# Altium project sigmaDeltaAltium.PrjPcb
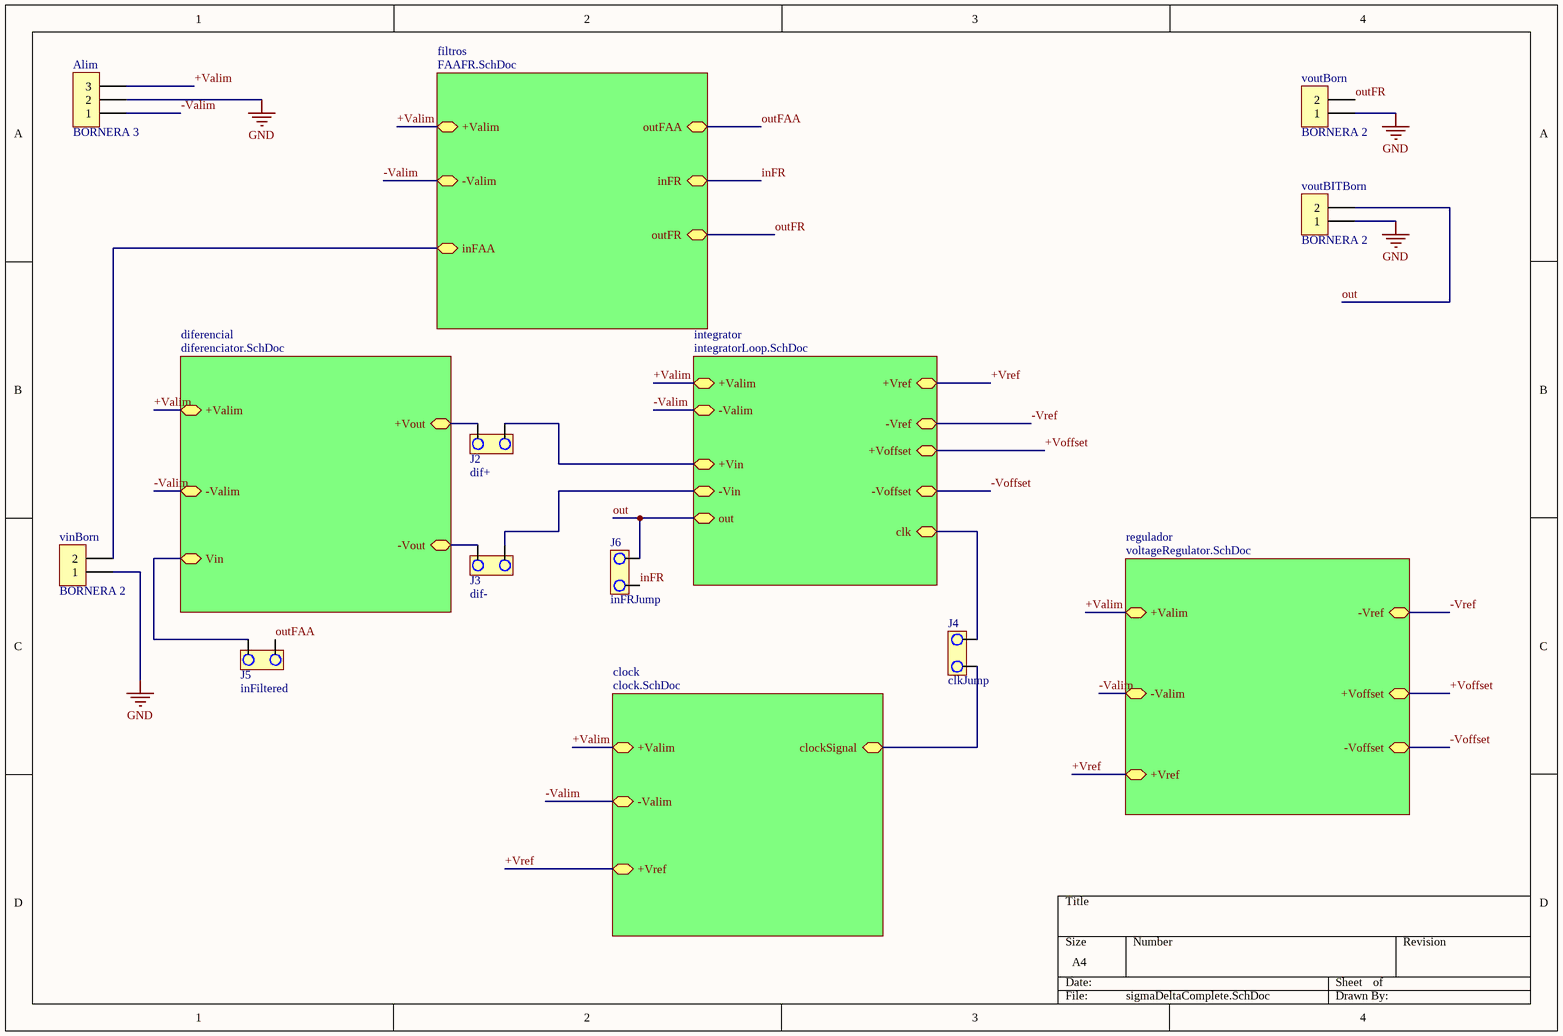
[diagram p0: sigmaDeltaComplete.SchDoc]
6 sheets, 68 parts. Net scope: hierarchical (ports join the sheet entries above them; power ports are global).
Board file: sigmaDeltaAUX.PcbDoc
Sheets:
  sigmaDeltaComplete.SchDoc
    integrator = integratorLoop.SchDoc
    clock = clock.SchDoc
    diferencial = diferenciator.SchDoc
    regulador = voltageRegulator.SchDoc
    filtros = FAAFR.SchDoc

## Sheet sigmaDeltaComplete.SchDoc
size A4

### Parts
Alim  BORNERA 3  [BORNERA3]
J2  dif+  [JUMPER2]
J3  dif-  [JUMPER2]
J4  clkJump  [JUMPER2]
J5  inFiltered  [JUMPER2]
J6  inFRJump  [JUMPER2]
vinBorn  BORNERA 2  [BORNERA2]
voutBITBorn  BORNERA 2  [BORNERA2]
voutBorn  BORNERA 2  [BORNERA2]

### Sub-sheets
clock = clock.SchDoc: +Valim, -Valim, +Vref, clockSignal
diferencial = diferenciator.SchDoc: +Valim, -Valim, Vin, +Vout, -Vout
filtros = FAAFR.SchDoc: +Valim, -Valim, inFAA, outFAA, inFR, outFR
integrator = integratorLoop.SchDoc: +Valim, -Valim, +Vin, -Vin, out, +Vref, -Vref, +Voffset, -Voffset, clk
regulador = voltageRegulator.SchDoc: +Valim, -Valim, +Vref, -Vref, +Voffset, -Voffset

### Nets
GND: Alim.2 vinBorn.1 voutBITBorn.1 voutBorn.1
+Valim: Alim.3 ; sheet integrator/+Valim, sheet clock/+Valim, sheet diferencial/+Valim, sheet regulador/+Valim, sheet filtros/+Valim
+Vin: J2.2 ; sheet integrator/+Vin
+Voffset: sheet integrator/+Voffset, sheet regulador/+Voffset
+Vout: J2.1 ; sheet diferencial/+Vout
+Vref: sheet integrator/+Vref, sheet clock/+Vref, sheet regulador/+Vref
-Valim: Alim.1 ; sheet integrator/-Valim, sheet clock/-Valim, sheet diferencial/-Valim, sheet regulador/-Valim, sheet filtros/-Valim
-Vin: J3.2 ; sheet integrator/-Vin
-Voffset: sheet integrator/-Voffset, sheet regulador/-Voffset
-Vout: J3.1 ; sheet diferencial/-Vout
-Vref: sheet integrator/-Vref, sheet regulador/-Vref
clk: J4.1 ; sheet integrator/clk
clockSignal: J4.2 ; sheet clock/clockSignal
inFR: J6.2 ; sheet filtros/inFR
out: J6.1 voutBITBorn.2 ; sheet integrator/out  [project net analogResult2]
outFAA: J5.2 ; sheet filtros/outFAA
outFR: voutBorn.2 ; sheet filtros/outFR
NetJ5_1: J5.1 ; sheet diferencial/Vin
NetR1_filtros_2: vinBorn.2 ; sheet filtros/inFAA

### Library data of the parts
J2-J6 = JUMPER

## Sheet integratorLoop.SchDoc
size A4
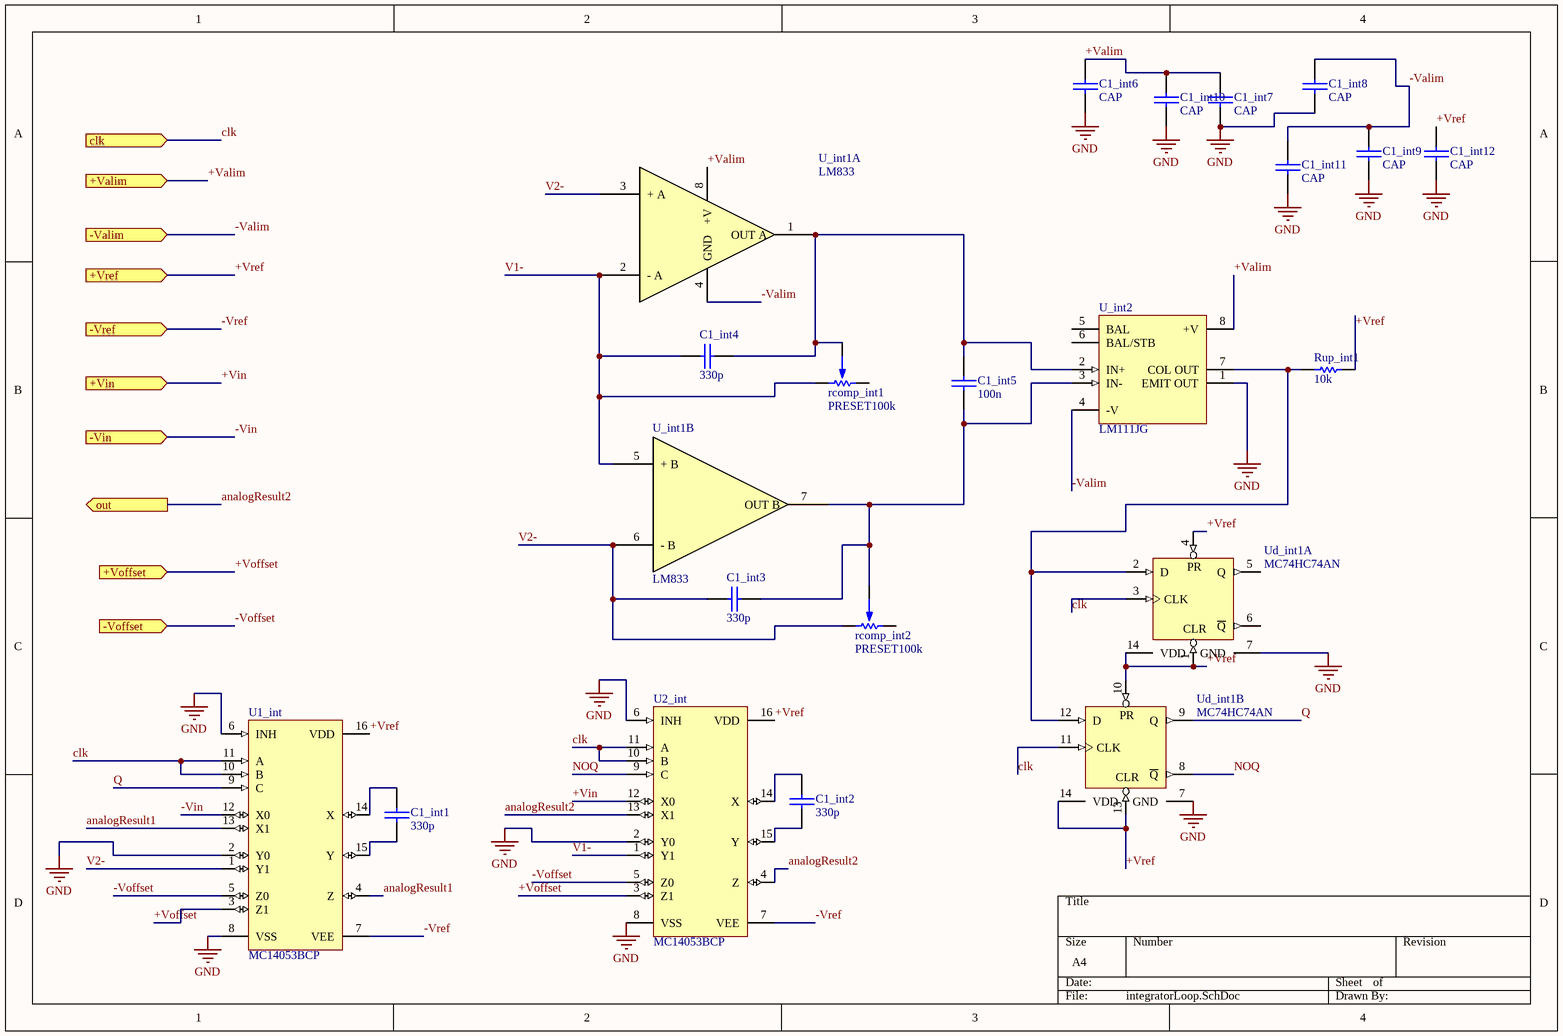
[diagram p1: integratorLoop.SchDoc]

### Parts
C1_int1  330p  [CAP200]
C1_int2  330p  [CAP200]
C1_int3  330p  [CAP200]
C1_int4  330p  [CAP200]
C1_int5  100n  [CAP200]
C1_int6  CAP  [CAP200]
C1_int7  CAP  [CAP200]
C1_int8  CAP  [CAP200]
C1_int9  CAP  [CAP200]
C1_int10  CAP  [CAP200]
C1_int11  CAP  [CAP200]
C1_int12  CAP  [CAP200]
rcomp_int1  PRESET100k  [PRESET V]
rcomp_int2  PRESET100k  [PRESET V]
Rup_int1  10k  [RES300]
U1_int  MC14053BCP  [648-08]
U2_int  MC14053BCP  [648-08]
U_int1  LM833  [DIP8]  (parts A,B of 2)
U_int2  LM111JG  [JG008]
Ud_int1  MC74HC74AN  [646-06]  (parts A,B of 2)

### Ports
+Valim (in), +Vin (in), +Voffset (in), +Vref (in), -Valim (in), -Vin (in), -Voffset (in), -Vref (in), clk (in), out (out)

### Nets
GND: C1_int6.2 C1_int7.2 C1_int8.2 C1_int9.2 C1_int10.2 C1_int11.2 C1_int12.2 U1_int.2(Y0) U1_int.6(INH) U1_int.8(VSS) U2_int.2(Y0) U2_int.6(INH) U2_int.8(VSS) U_int2.1(EMIT_OUT) Ud_int1.7(GND)
+Valim: C1_int6.1 C1_int7.1 C1_int10.1 U_int1.8(+V) U_int2.8(+V) ; port +Valim
+Vin: U2_int.12(X0) ; port +Vin
+Voffset: U1_int.3(Z1) U2_int.3(Z1) ; port +Voffset
+Vref: C1_int12.1 Rup_int1.2 U1_int.16(VDD) U2_int.16(VDD) Ud_int1.1(CLR) Ud_int1.4(PR) Ud_int1.10(PR) Ud_int1.13(CLR) Ud_int1.14(VDD) ; port +Vref
-Valim: C1_int8.1 C1_int9.1 C1_int11.1 U_int1.4(GND) U_int2.4(-V) ; port -Valim
-Vin: U1_int.12(X0) ; port -Vin
-Voffset: U1_int.5(Z0) U2_int.5(Z0) ; port -Voffset
-Vref: U1_int.7(VEE) U2_int.7(VEE) ; port -Vref
analogResult1: U1_int.4(Z) U1_int.13(X1)
analogResult2: U2_int.4(Z) U2_int.13(X1) ; port out
clk: U1_int.10(B) U1_int.11(A) U2_int.10(B) U2_int.11(A) Ud_int1.3(CLK) Ud_int1.11(CLK) ; port clk
NOQ: U2_int.9(C) Ud_int1.8(~{Q})
Q: U1_int.9(C) Ud_int1.9(Q)
V1-: C1_int4.1 rcomp_int1.1 U2_int.1(Y1) U_int1.2(-_A) U_int1.5(+_B)
V2-: C1_int3.1 rcomp_int2.1 U1_int.1(Y1) U_int1.3(+_A) U_int1.6(-_B)
NetC1_int1_1: C1_int1.1 U1_int.14(X)
NetC1_int1_2: C1_int1.2 U1_int.15(Y)
NetC1_int2_1: C1_int2.1 U2_int.14(X)
NetC1_int2_2: C1_int2.2 U2_int.15(Y)
NetC1_int3_2: C1_int3.2 C1_int5.2 rcomp_int2.2 U_int1.7(OUT_B) U_int2.3(IN-)
NetC1_int4_2: C1_int4.2 C1_int5.1 rcomp_int1.2 U_int1.1(OUT_A) U_int2.2(IN+)
NetRup_int1_1: Rup_int1.1 U_int2.7(COL_OUT) Ud_int1.2(D) Ud_int1.12(D)

Not connected (* = marked no-connect by the designer): rcomp_int1 3; rcomp_int2 3; U_int2 5(BAL) 6(BAL/STB); Ud_int1 5(Q) 6(~{Q})

### Library data of the parts
C1_int1-C1_int5 = CAP
rcomp_int1 rcomp_int2 = PRESET
Rup_int1 = RES
U1_int U2_int = MC14053BCP: Triple 2-Channel Analog Multiplexer/Demultiplexer; Published: 15-Apr-2002; DatasheetVersion: 1995; PackageVersion: Apr-2000; PackageReference: 648-08; Publisher: Altium Limited; PackageDescription: DIP; 16 Leads; Row Spacing 7.62 mm; Pitch 2.54 mm; Code_JEDEC: MS-001-BB; ComponentLink1Description: Manufacturer Link; ComponentLink1URL: http://www.onsemi.com/; ComponentLink2Description: Datasheet; ComponentLink2URL: http://www.onsemi.com/pub/Collateral/MC14051B-D.PDF
U_int1 = LM833: Dual Audio Operational Amplifier
U_int2 = LM111JG: Differential Comparator with Strobe; Published: 16-Jan-2001; LatestRevisionDate: 04-Mar-2005; LatestRevisionNote: Stylized 3D Model Added.; DatasheetVersion: Feb-1992; PackageVersion: Jan-1995; PackageReference: JG008; Publisher: Altium Limited; PackageDescription: DIP; 8 Leads; Row Spacing 7.62 mm; Pitch 2.54 mm; ComponentLink1Description: Manufacturer Link; ComponentLink1URL: http://www.ti.com/; ComponentLink2Description: Datasheet; ComponentLink2URL: http://www-s.ti.com/sc/ds/lm111.pdf
Ud_int1 = MC74HC74AN: Dual D-Type Flip-Flop with Set and Reset; Published: 15-Apr-2002; DatasheetVersion: Mar-2000; PackageVersion: 1995; PackageReference: 646-06; Publisher: Altium Limited; PackageDescription: DIP; 14 Leads; Row Spacing 7.62 mm; Pitch 2.54 mm; ComponentLink1Description: Manufacturer Link; ComponentLink1URL: http://www.onsemi.com/; ComponentLink2Description: Datasheet; ComponentLink2URL: http://www.onsemi.com/pub/Collateral/MC74HC74A-D.PDF

## Sheet clock.SchDoc
size A4
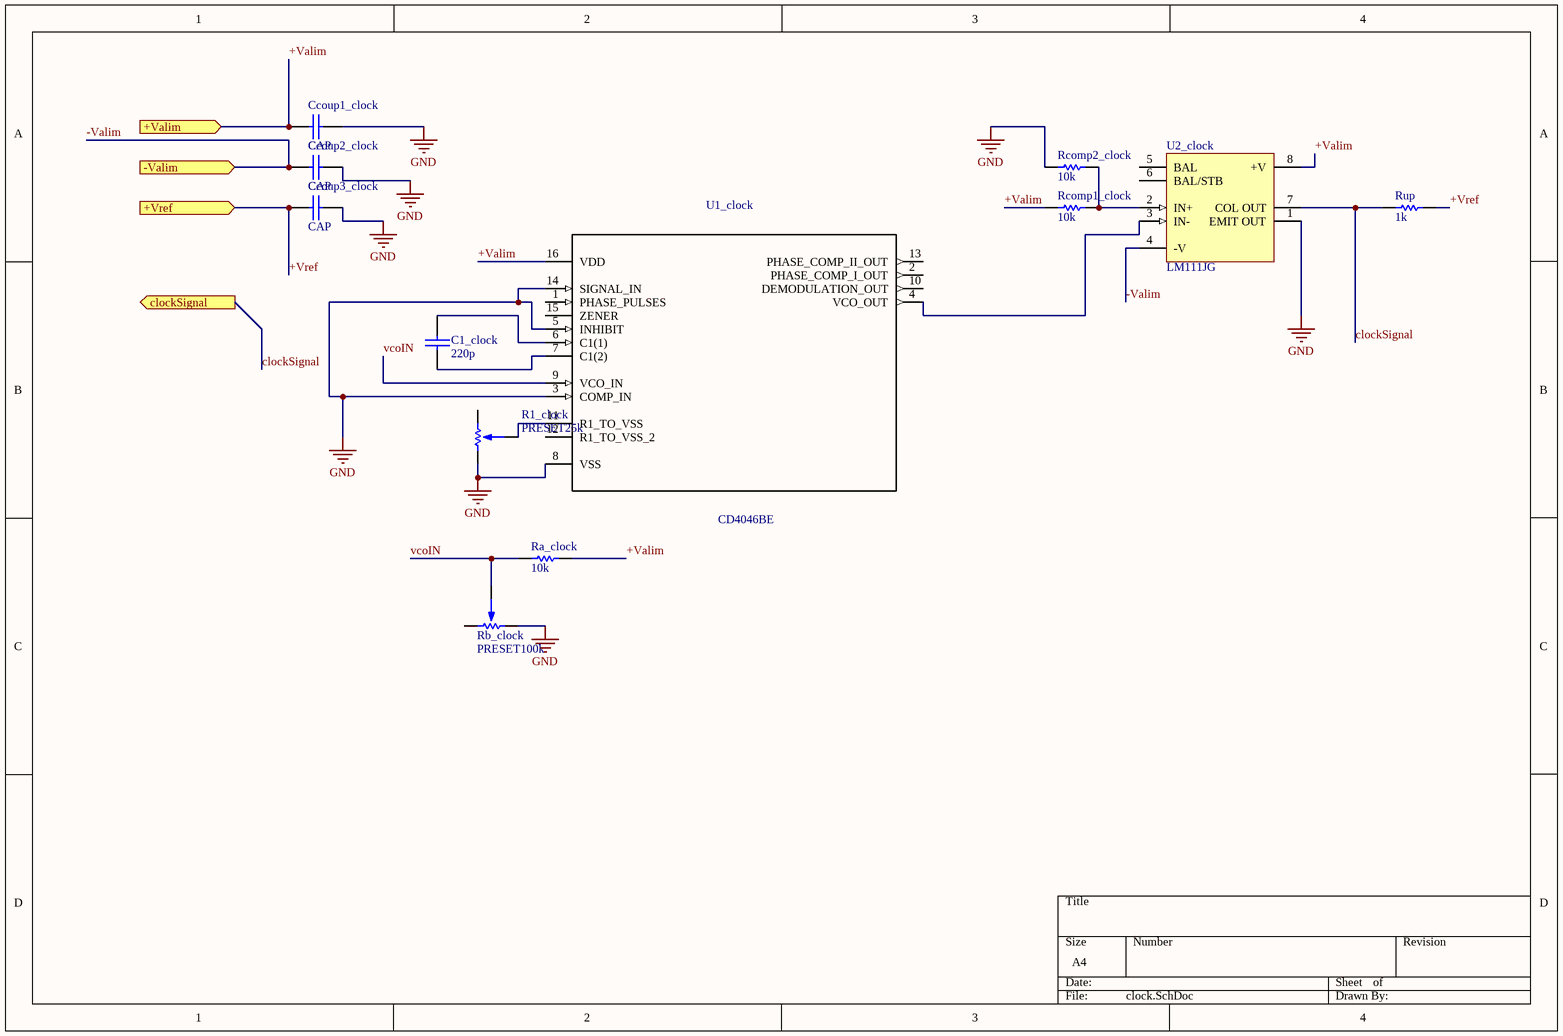
[diagram p2: clock.SchDoc]

### Parts
C1_clock  220p  [CAP200]
Ccoup1_clock  CAP  [CAP200]
Ccoup2_clock  CAP  [CAP200]
Ccoup3_clock  CAP  [CAP200]
R1_clock  PRESET25k  [PRESET V]
Ra_clock  10k  [RES300]
Rb_clock  PRESET100k  [PRESET V]
Rcomp1_clock  10k  [RES300]
Rcomp2_clock  10k  [RES300]
Rup  1k  [RES300]
U1_clock  CD4046BE  [DIP254P762X508-16]
U2_clock  LM111JG  [JG008]

### Ports
+Valim (in), +Vref (in), -Valim (in), clockSignal (out)

### Nets
GND: Ccoup1_clock.2 Ccoup2_clock.2 Ccoup3_clock.2 R1_clock.3 Rb_clock.3 Rcomp2_clock.1 U1_clock.3(COMP_IN) U1_clock.5(INHIBIT) U1_clock.8(VSS) U1_clock.14(SIGNAL_IN) U2_clock.1(EMIT_OUT)
+Valim: Ccoup1_clock.1 Ra_clock.2 Rcomp1_clock.1 U1_clock.16(VDD) U2_clock.8(+V) ; port +Valim
+Vref: Ccoup3_clock.1 Rup.2 ; port +Vref
-Valim: Ccoup2_clock.1 U2_clock.4(-V) ; port -Valim
clockSignal: Rup.1 U2_clock.7(COL_OUT) ; port clockSignal
vcoIN: Ra_clock.1 Rb_clock.2 U1_clock.9(VCO_IN)
NetC1_clock_1: C1_clock.1 U1_clock.6(C1(1))
NetC1_clock_2: C1_clock.2 U1_clock.7(C1(2))
NetR1_clock_2: R1_clock.2 U1_clock.11(R1_TO_VSS)
NetRcomp1_clock_2: Rcomp1_clock.2 Rcomp2_clock.2 U2_clock.2(IN+)
NetU1_clock_4: U1_clock.4(VCO_OUT) U2_clock.3(IN-)

Not connected (* = marked no-connect by the designer): R1_clock 1; Rb_clock 1; U1_clock 1(PHASE_PULSES) 2(PHASE_COMP_I_OUT) 10(DEMODULATION_OUT) 12(R1_TO_VSS_2) 13(PHASE_COMP_II_OUT) 15(ZENER); U2_clock 5(BAL) 6(BAL/STB)

### Library data of the parts
C1_clock = CAP
R1_clock Rb_clock = PRESET
Ra_clock Rcomp1_clock Rcomp2_clock Rup = RES
U1_clock = CD4046BE: Logic - Phase-Locked-Loops and Oscillators Micropower PLL; MF: Texas Instruments; SnapEDA_Link: https://www.snapeda.com/parts/CD4046BE/Texas%20Instruments/view-part/?ref=snap; Availability: Unavailable; Package: PDIP-16 Texas Instruments; Price: None; MP: CD4046BE; Value: *
U2_clock = LM111JG: Differential Comparator with Strobe; Published: 16-Jan-2001; LatestRevisionDate: 04-Mar-2005; LatestRevisionNote: Stylized 3D Model Added.; DatasheetVersion: Feb-1992; PackageVersion: Jan-1995; PackageReference: JG008; Publisher: Altium Limited; PackageDescription: DIP; 8 Leads; Row Spacing 7.62 mm; Pitch 2.54 mm; ComponentLink1Description: Manufacturer Link; ComponentLink1URL: http://www.ti.com/; ComponentLink2Description: Datasheet; ComponentLink2URL: http://www-s.ti.com/sc/ds/lm111.pdf

## Sheet diferenciator.SchDoc
size A4
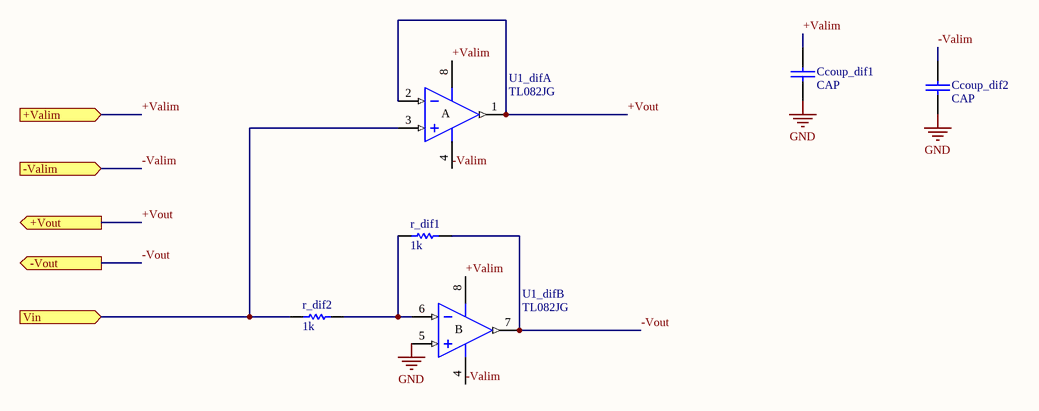
[diagram p3: diferenciator.SchDoc]

### Parts
Ccoup_dif1  CAP  [CAP200]
Ccoup_dif2  CAP  [CAP200]
r_dif1  1k  [RES300]
r_dif2  1k  [RES300]
U1_dif  TL082JG  [JG008]  (parts A,B of 2)

### Ports
+Valim (in), +Vout (out), -Valim (in), -Vout (out), Vin (in)

### Nets
GND: Ccoup_dif1.2 Ccoup_dif2.2 U1_dif.5(IN+)
+Valim: Ccoup_dif1.1 U1_dif.8(V+) ; port +Valim
+Vout: U1_dif.1(OUT) U1_dif.2(IN-) ; port +Vout
-Valim: Ccoup_dif2.1 U1_dif.4(V-) ; port -Valim
-Vout: r_dif1.2 U1_dif.7(OUT) ; port -Vout
NetJ5_1: r_dif2.1 U1_dif.3(IN+) ; port Vin
Netr_dif1_1: r_dif1.1 r_dif2.2 U1_dif.6(IN-)

### Notes on the sheet
- (in symbol TL082JG, part A) A
- (in symbol TL082JG, part B) B

### Library data of the parts
r_dif1 r_dif2 = RES
U1_dif = TL082JG: JFET-Input Operational Amplifier; Published: 16-Jan-2001; LatestRevisionDate: 04-Mar-2005; LatestRevisionNote: Stylized 3D Model Added.; DatasheetVersion: Feb-1999; PackageVersion: Jan-1995; PackageReference: JG008; Publisher: Altium Limited; PackageDescription: DIP; 8 Leads; Row Spacing 7.62 mm; Pitch 2.54 mm; ComponentLink1Description: Manufacturer Link; ComponentLink1URL: http://www.ti.com/; ComponentLink2Description: Datasheet; ComponentLink2URL: http://www-s.ti.com/sc/ds/tl082.pdf

## Sheet voltageRegulator.SchDoc
size A4
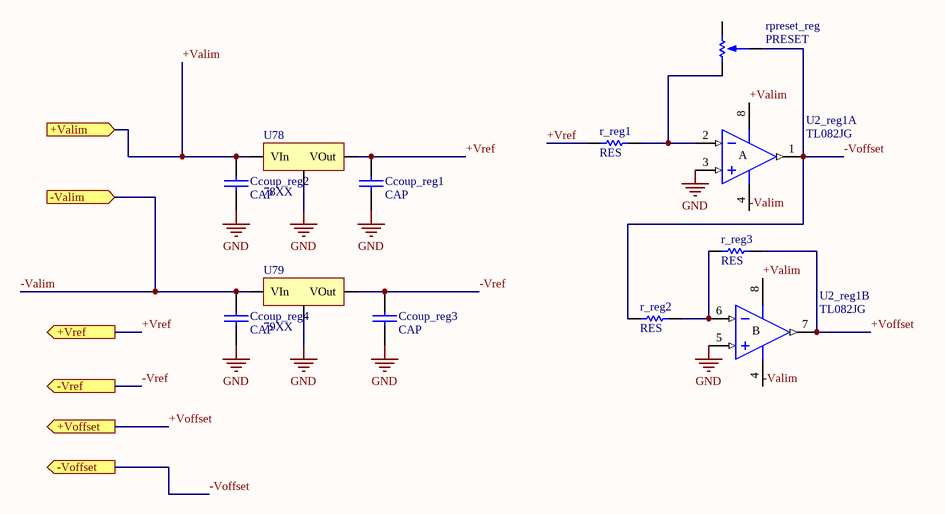
[diagram p4: voltageRegulator.SchDoc]

### Parts
Ccoup_reg1  CAP  [CAP200]
Ccoup_reg2  CAP  [CAP200]
Ccoup_reg3  CAP  [CAP200]
Ccoup_reg4  CAP  [CAP200]
r_reg1  RES  [RES300]
r_reg2  RES  [RES300]
r_reg3  RES  [RES300]
rpreset_reg  PRESET  [PRESET V]
U2_reg1  TL082JG  [JG008]  (parts A,B of 2)
U78  78XX  [TO-220 H - DISIPADOR]
U79  79XX  [TO-220 H - DISIPADOR]

### Ports
+Valim (in), +Voffset (out), +Vref (out), -Valim (in), -Voffset (out), -Vref (out)

### Nets
GND: Ccoup_reg1.2 Ccoup_reg2.2 Ccoup_reg3.2 Ccoup_reg4.2 U2_reg1.3(IN+) U2_reg1.5(IN+) U78.2(GND) U79.1(GND)
+Valim: Ccoup_reg2.1 U2_reg1.8(V+) U78.1(VIn) ; port +Valim
+Voffset: r_reg3.2 U2_reg1.7(OUT) ; port +Voffset
+Vref: Ccoup_reg1.1 r_reg1.1 U78.3(VOut) ; port +Vref
-Valim: Ccoup_reg4.1 U2_reg1.4(V-) U79.2(VIn) ; port -Valim
-Voffset: r_reg2.1 rpreset_reg.2 U2_reg1.1(OUT) ; port -Voffset
-Vref: Ccoup_reg3.1 U79.3(VOut) ; port -Vref
Netr_reg1_2: r_reg1.2 rpreset_reg.3 U2_reg1.2(IN-)
Netr_reg2_2: r_reg2.2 r_reg3.1 U2_reg1.6(IN-)

Not connected (* = marked no-connect by the designer): rpreset_reg 1

### Notes on the sheet
- (in symbol TL082JG, part A) A
- (in symbol TL082JG, part B) B

### Library data of the parts
U2_reg1 = TL082JG: JFET-Input Operational Amplifier; Published: 16-Jan-2001; LatestRevisionDate: 04-Mar-2005; LatestRevisionNote: Stylized 3D Model Added.; DatasheetVersion: Feb-1999; PackageVersion: Jan-1995; PackageReference: JG008; Publisher: Altium Limited; PackageDescription: DIP; 8 Leads; Row Spacing 7.62 mm; Pitch 2.54 mm; ComponentLink1Description: Manufacturer Link; ComponentLink1URL: http://www.ti.com/; ComponentLink2Description: Datasheet; ComponentLink2URL: http://www-s.ti.com/sc/ds/tl082.pdf
U78 = 78XX: REGULDOR POSITIVO
U79 = 79XX: REGULADOR NEGATIVO

## Sheet FAAFR.SchDoc
size A4
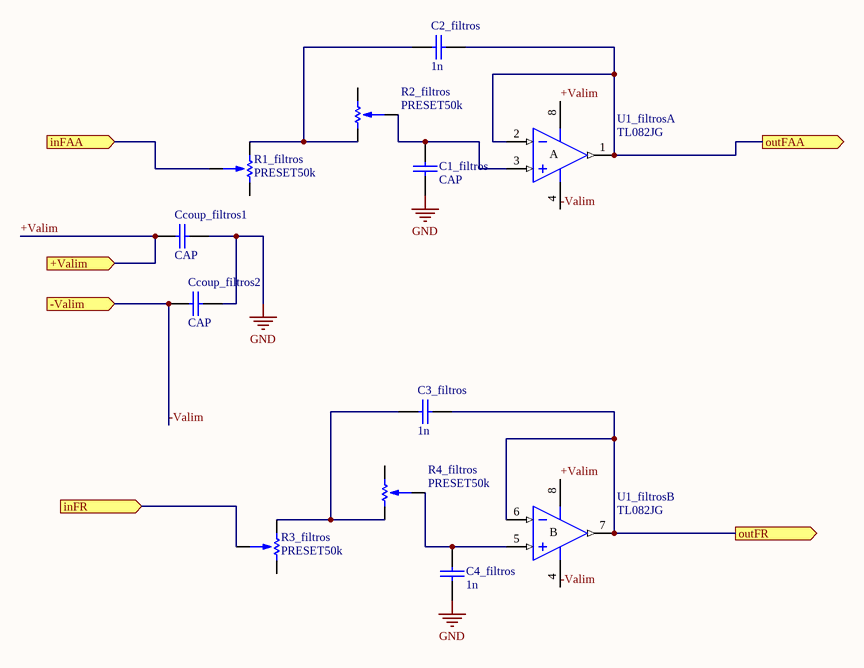
[diagram p5: FAAFR.SchDoc]

### Parts
C1_filtros  CAP  [CAP200]
C2_filtros  1n  [CAP200]
C3_filtros  1n  [CAP200]
C4_filtros  1n  [CAP200]
Ccoup_filtros1  CAP  [CAP200]
Ccoup_filtros2  CAP  [CAP200]
R1_filtros  PRESET50k  [PRESET V]
R2_filtros  PRESET50k  [PRESET V]
R3_filtros  PRESET50k  [PRESET V]
R4_filtros  PRESET50k  [PRESET V]
U1_filtros  TL082JG  [JG008]  (parts A,B of 2)

### Ports
+Valim (in), -Valim (in), inFAA (in), inFR (in), outFAA (out), outFR (out)

### Nets
GND: C1_filtros.2 C4_filtros.1 Ccoup_filtros1.2 Ccoup_filtros2.2
+Valim: Ccoup_filtros1.1 U1_filtros.8(V+) ; port +Valim
-Valim: Ccoup_filtros2.1 U1_filtros.4(V-) ; port -Valim
inFR: R3_filtros.2 ; port inFR
outFAA: C2_filtros.2 U1_filtros.1(OUT) U1_filtros.2(IN-) ; port outFAA
outFR: C3_filtros.2 U1_filtros.6(IN-) U1_filtros.7(OUT) ; port outFR
NetC1_filtros_1: C1_filtros.1 R2_filtros.2 U1_filtros.3(IN+)
NetC2_filtros_1: C2_filtros.1 R1_filtros.3 R2_filtros.3
NetC3_filtros_1: C3_filtros.1 R3_filtros.3 R4_filtros.3
NetC4_filtros_2: C4_filtros.2 R4_filtros.2 U1_filtros.5(IN+)
NetR1_filtros_2: R1_filtros.2 ; port inFAA

Not connected (* = marked no-connect by the designer): R1_filtros 1; R2_filtros 1; R3_filtros 1; R4_filtros 1

### Notes on the sheet
- (in symbol TL082JG, part A) A
- (in symbol TL082JG, part B) B

### Library data of the parts
C2_filtros C3_filtros C4_filtros = CAP
R1_filtros R2_filtros R3_filtros R4_filtros = PRESET
U1_filtros = TL082JG: JFET-Input Operational Amplifier; Published: 16-Jan-2001; LatestRevisionDate: 04-Mar-2005; LatestRevisionNote: Stylized 3D Model Added.; DatasheetVersion: Feb-1999; PackageVersion: Jan-1995; PackageReference: JG008; Publisher: Altium Limited; PackageDescription: DIP; 8 Leads; Row Spacing 7.62 mm; Pitch 2.54 mm; ComponentLink1Description: Manufacturer Link; ComponentLink1URL: http://www.ti.com/; ComponentLink2Description: Datasheet; ComponentLink2URL: http://www-s.ti.com/sc/ds/tl082.pdf

## Nets that join several sheets
GND: sigmaDeltaComplete (Alim.2 vinBorn.1 voutBITBorn.1 voutBorn.1), integratorLoop (15 pins), clock (11 pins), diferenciator (Ccoup_dif1.2 Ccoup_dif2.2 U1_dif.5), voltageRegulator (8 pins), FAAFR (C1_filtros.2 C4_filtros.1 Ccoup_filtros1.2 Ccoup_filtros2.2)
+Valim: sigmaDeltaComplete (Alim.3), integratorLoop (5 pins), clock (5 pins), diferenciator (Ccoup_dif1.1 U1_dif.8), voltageRegulator (Ccoup_reg2.1 U2_reg1.8 U78.1), FAAFR (Ccoup_filtros1.1 U1_filtros.8)
+Vin: sigmaDeltaComplete (J2.2), integratorLoop (U2_int.12)
+Voffset: integratorLoop (U1_int.3 U2_int.3), voltageRegulator (r_reg3.2 U2_reg1.7)
+Vout: sigmaDeltaComplete (J2.1), diferenciator (U1_dif.1 U1_dif.2)
+Vref: integratorLoop (9 pins), clock (Ccoup3_clock.1 Rup.2), voltageRegulator (Ccoup_reg1.1 r_reg1.1 U78.3)
-Valim: sigmaDeltaComplete (Alim.1), integratorLoop (5 pins), clock (Ccoup2_clock.1 U2_clock.4), diferenciator (Ccoup_dif2.1 U1_dif.4), voltageRegulator (Ccoup_reg4.1 U2_reg1.4 U79.2), FAAFR (Ccoup_filtros2.1 U1_filtros.4)
-Vin: sigmaDeltaComplete (J3.2), integratorLoop (U1_int.12)
-Voffset: integratorLoop (U1_int.5 U2_int.5), voltageRegulator (r_reg2.1 rpreset_reg.2 U2_reg1.1)
-Vout: sigmaDeltaComplete (J3.1), diferenciator (r_dif1.2 U1_dif.7)
-Vref: integratorLoop (U1_int.7 U2_int.7), voltageRegulator (Ccoup_reg3.1 U79.3)
analogResult2: sigmaDeltaComplete (J6.1 voutBITBorn.2), integratorLoop (U2_int.4 U2_int.13)
clk: sigmaDeltaComplete (J4.1), integratorLoop (6 pins)
clockSignal: sigmaDeltaComplete (J4.2), clock (Rup.1 U2_clock.7)
inFR: sigmaDeltaComplete (J6.2), FAAFR (R3_filtros.2)
NetJ5_1: sigmaDeltaComplete (J5.1), diferenciator (r_dif2.1 U1_dif.3)
NetR1_filtros_2: sigmaDeltaComplete (vinBorn.2), FAAFR (R1_filtros.2)
outFAA: sigmaDeltaComplete (J5.2), FAAFR (C2_filtros.2 U1_filtros.1 U1_filtros.2)
outFR: sigmaDeltaComplete (voutBorn.2), FAAFR (C3_filtros.2 U1_filtros.6 U1_filtros.7)